# Altium schematic sheet 03_B2B_CON_P101-P200.SchDoc: PiMX8MP Board to board connector P100 - P200
size 420 x 297 mm; Author: T. Ludemann; SheetNumber: 3; SheetTotal: 8; DocSize: DINA3
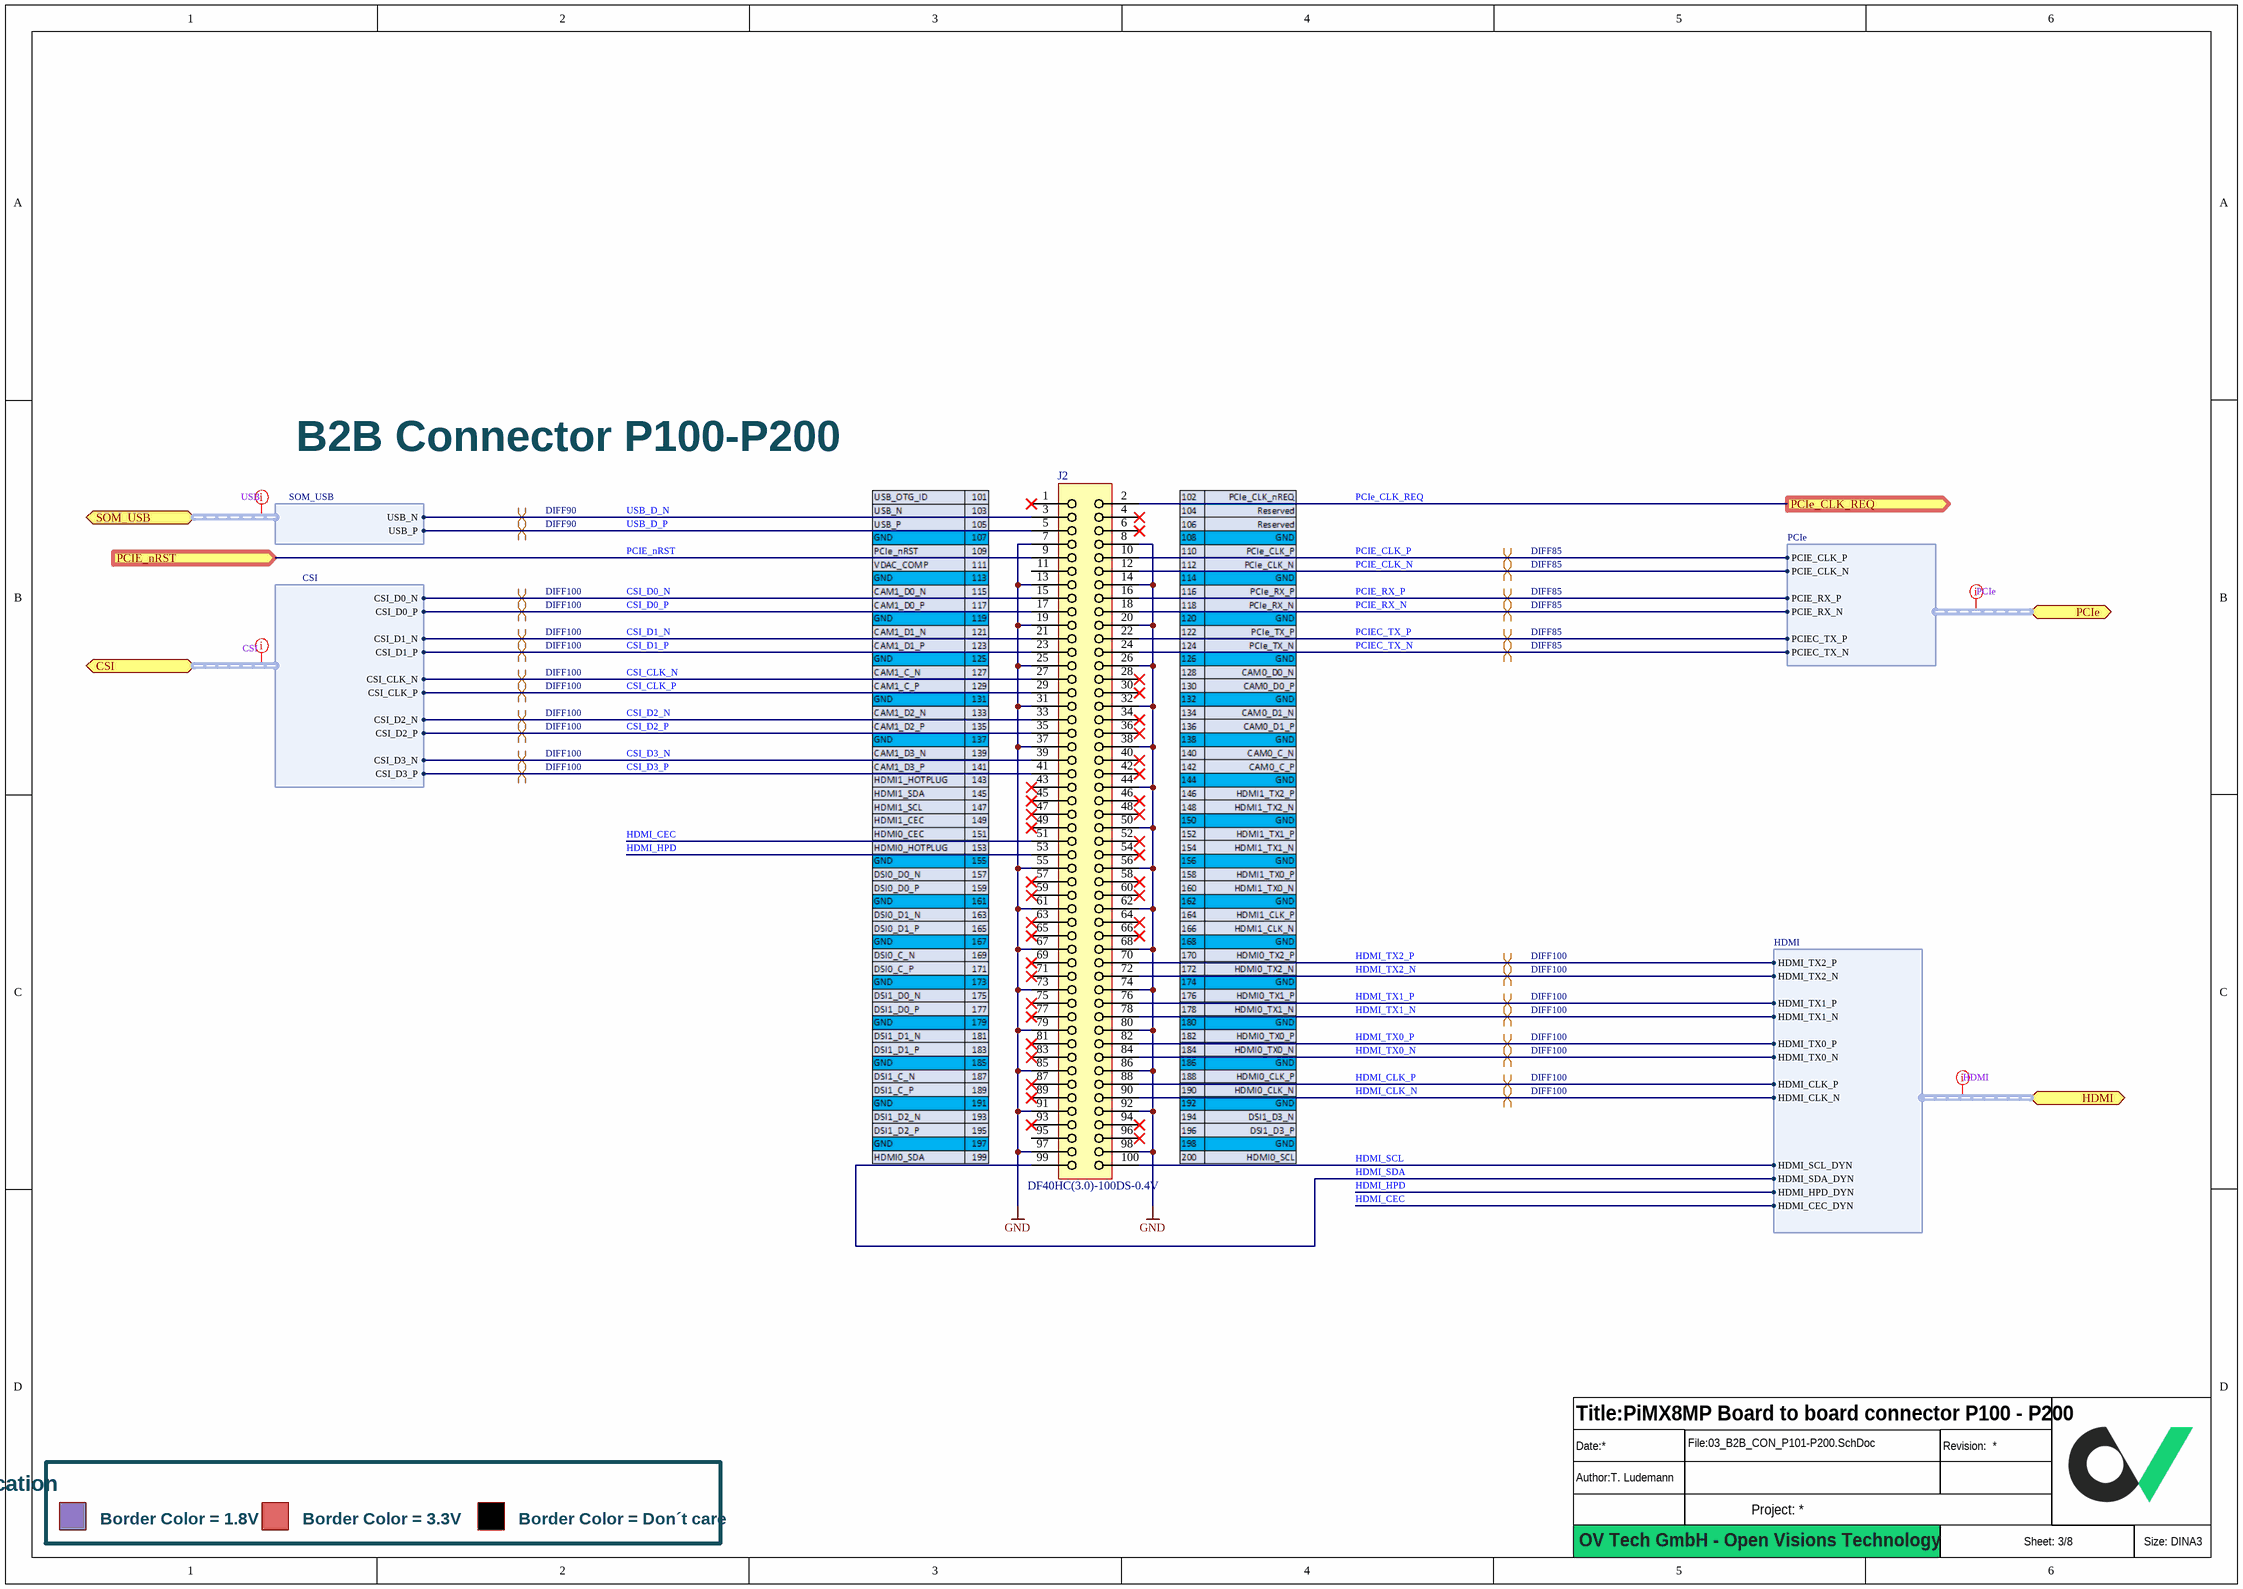
[diagram p0: 03_B2B_CON_P101-P200.SchDoc]

## Parts
?  (no value)  (graphical)
J2  DF40HC(3.0)-100DS-0.4V  [BOARD-TO-BOARD DF40HC(3.0)-100DS-0.4V]

## Ports
CSI (bidir, harness CSI), HDMI (bidir, harness HDMI), PCIe (bidir, harness PCIe), PCIe_CLK_REQ (out), PCIE_nRST (in), SOM_USB (bidir, harness SOM_USB)

## Harnesses
SOM_USB: USB_P, USB_N
HDMI: HDMI_SCL_DYN, HDMI_SDA_DYN, HDMI_HPD_DYN, HDMI_CEC_DYN, HDMI_CLK_N, HDMI_CLK_P, HDMI_TX0_N, HDMI_TX0_P, HDMI_TX1_N, HDMI_TX1_P, HDMI_TX2_N, HDMI_TX2_P
CSI: CSI_D0_N, CSI_D0_P, CSI_D1_N, CSI_D1_P, CSI_CLK_N, CSI_CLK_P, CSI_D2_N, CSI_D2_P, CSI_D3_N, CSI_D3_P
PCIe: PCIE_CLK_N, PCIE_CLK_P, PCIEC_TX_N, PCIE_RX_P, PCIE_RX_N, PCIEC_TX_P

## Nets
GND: J2.7 J2.8 J2.13 J2.14 J2.19 J2.20 J2.25 J2.26 J2.31 J2.32 J2.37 J2.38 J2.44 J2.50 J2.55 J2.56 J2.61 J2.62 J2.67 J2.68 J2.73 J2.74 J2.79 J2.80 J2.85 J2.86 J2.91 J2.92 J2.97 J2.98
CSI_CLK_N: J2.27 ; port CSI.CSI_CLK_N
CSI_CLK_P: J2.29 ; port CSI.CSI_CLK_P
CSI_D0_N: J2.15 ; port CSI.CSI_D0_N
CSI_D0_P: J2.17 ; port CSI.CSI_D0_P
CSI_D1_N: J2.21 ; port CSI.CSI_D1_N
CSI_D1_P: J2.23 ; port CSI.CSI_D1_P
CSI_D2_N: J2.33 ; port CSI.CSI_D2_N
CSI_D2_P: J2.35 ; port CSI.CSI_D2_P
CSI_D3_N: J2.39 ; port CSI.CSI_D3_N
CSI_D3_P: J2.41 ; port CSI.CSI_D3_P
HDMI_CEC: J2.51 ; port HDMI.HDMI_CEC_DYN
HDMI_CLK_N: J2.90 ; port HDMI.HDMI_CLK_N
HDMI_CLK_P: J2.88 ; port HDMI.HDMI_CLK_P
HDMI_HPD: J2.53 ; port HDMI.HDMI_HPD_DYN
HDMI_SCL: J2.100 ; port HDMI.HDMI_SCL_DYN
HDMI_SDA: J2.99 ; port HDMI.HDMI_SDA_DYN
HDMI_TX0_N: J2.84 ; port HDMI.HDMI_TX0_N
HDMI_TX0_P: J2.82 ; port HDMI.HDMI_TX0_P
HDMI_TX1_N: J2.78 ; port HDMI.HDMI_TX1_N
HDMI_TX1_P: J2.76 ; port HDMI.HDMI_TX1_P
HDMI_TX2_N: J2.72 ; port HDMI.HDMI_TX2_N
HDMI_TX2_P: J2.70 ; port HDMI.HDMI_TX2_P
PCIE_CLK_N: J2.12 ; port PCIe.PCIE_CLK_N
PCIE_CLK_P: J2.10 ; port PCIe.PCIE_CLK_P
PCIe_CLK_REQ: J2.2 ; port PCIe_CLK_REQ
PCIE_nRST: J2.9 ; port PCIE_nRST
PCIE_RX_N: J2.18 ; port PCIe.PCIE_RX_N
PCIE_RX_P: J2.16 ; port PCIe.PCIE_RX_P
PCIEC_TX_N: J2.24 ; port PCIe.PCIEC_TX_N
PCIEC_TX_P: J2.22 ; port PCIe.PCIEC_TX_P
USB_D_N: J2.3 ; port SOM_USB.USB_N
USB_D_P: J2.5 ; port SOM_USB.USB_P

Not connected (* = marked no-connect by the designer): J2 1* 4* 6* 11 28* 30* 34* 36* 40* 42* 43* 45* 46* 47* 48* 49* 52* 54* 57* 58* 59* 60* 63* 64* 65* 66* 69* 71* 75* 77* 81* 83* 87* 89* 93* 94* 95 96*

## Layout directives
net class USB: (no net found under the mark)
net class HDMI: (no net found under the mark)
differential pair; differential pair class DIFF100: CSI_CLK_N, CSI_CLK_P, CSI_D0_N, CSI_D0_P, CSI_D1_N, CSI_D1_P, CSI_D2_N, CSI_D2_P, CSI_D3_N, CSI_D3_P, HDMI_CLK_N, HDMI_CLK_P, HDMI_TX0_N, HDMI_TX0_P, HDMI_TX1_N, HDMI_TX1_P, HDMI_TX2_N, HDMI_TX2_P
differential pair; differential pair class DIFF90: USB_D_N, USB_D_P
net class CSI: (no net found under the mark)
net class PCIe: (no net found under the mark)
differential pair; differential pair class DIFF85: PCIE_CLK_N, PCIE_CLK_P, PCIE_RX_N, PCIE_RX_P, PCIEC_TX_N, PCIEC_TX_P

## Notes on the sheet
- (near J2) B2B Connector P100-P200
- Signal Level Indication
- Border Color = 1.8V
- Border Color = 3.3V
- Border Color = Don´t care
- OV Tech GmbH - Open Visions Technology

## Library data of the parts
? = Titleblock_01_OpenSource
J2 = Board to Board Connector Receptable_BTB_100P_04mm_DF40HC(3.0)-100DS-0.4V: Board to Board connector 100Pol Stacking Header Receptable  0.4mm Pitch; Manufacturer 1: Hirose Connector; Manufacturer 1 Prt. Nr.: DF40HC(3.0)-100DS-0.4V